# EAGLE design fm_1 (EAGLE 9.2.1)
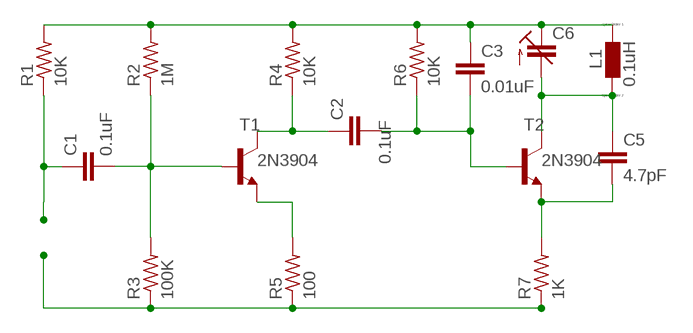
[diagram p0: schematic, sheet 1]

## Parts
C1  0.1uF  C-EU025-040X050  [C025-040X050]
C2  0.1uF  C-EU025-040X050  [C025-040X050]
C3  0.01uF  C-EU025-040X050  [C025-040X050]
C5  4.7pF  C-EU025-040X050  [C025-040X050]
C6  C-TRIMM808  [CTRIM808-BC]
L1  0.1uH  L0204/7  [0204/7]
R1  10K  R-US_0204/2V  [0204V]
R2  1M  R-US_0204/2V  [0204V]
R3  100K  R-US_0204/2V  [0204V]
R4  10K  R-US_0204/2V  [0204V]
R5  100  R-US_0204/2V  [0204V]
R6  10K  R-US_0204/2V  [0204V]
R7  1K  R-US_0204/2V  [0204V]
T1  2N3904  [TO92]
T2  2N3904  [TO92]

## Nets
N$1: C3.1 C6.1(E) L1.1 R1.2 R2.2 R4.2 R6.2
N$2: C1.1 R1.1
N$3: C1.2 R2.1 R3.2 T1.2(B)
N$4: R3.1 R5.1 R7.1
N$5: C2.1 R4.1 T1.1(C)
N$6: C2.2 C3.2 R6.1 T2.2(B)
N$7: C5.1 C6.2(A) L1.2 T2.1(C)
N$8: C5.2 R7.2 T2.3(E)
N$9: R5.2 T1.3(E)

## Library data of the parts
C1-C3 C5 = rcl:C-EU: CAPACITOR, European symbol; SPICEPREFIX: C
C6 = rcl:C-TRIMM: Trimm capacitor; SPICEPREFIX: C
L1 = eagle-ltspice:L: INDUCTOR, European symbol; SPICEMODEL: NONE; SPICEPREFIX: L
R1-R7 = rcl:R-US_: RESISTOR, American symbol; SPICEPREFIX: R
T1 T2 = transistor:2N3904: NPN TRANSISTOR

## Net classes
0 default: width 0.508 mm, drill 0.305 mm, clearance 0.508 mm

## Board
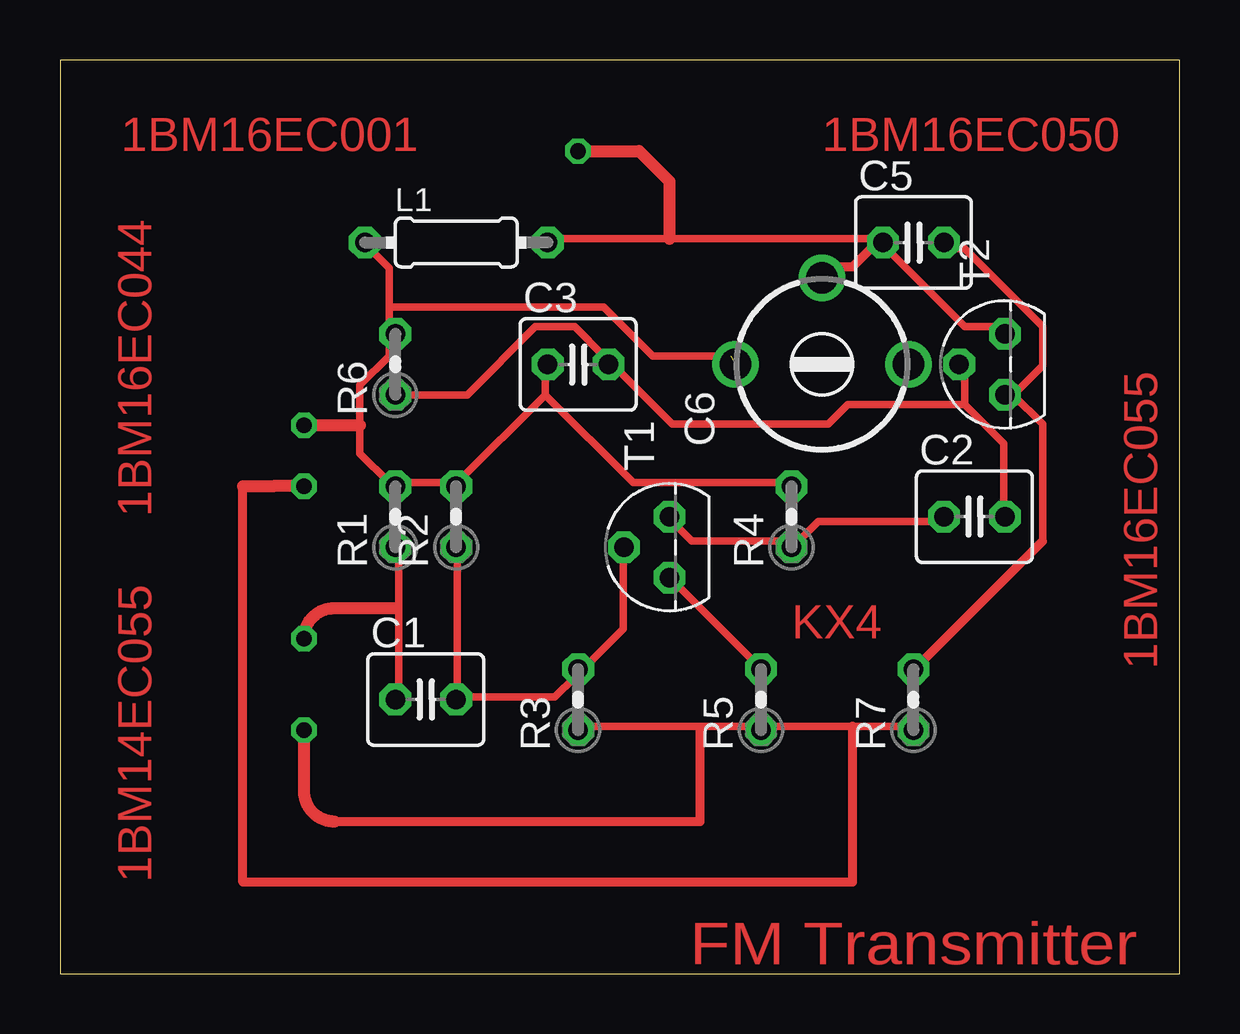
[diagram p1: board, top side]

Size 46.66 x 38.09 mm. Coordinates in mm from the lower left corner, seen from the top.
Outline: 0,0 46.66,0 46.66,38.09 0,38.09 0,0
Copper layers (1*16): Top 0.035mm / dielectric 1.5mm / Bottom 0.035mm
Design rules "default *": minimum track width 12mil, minimum drill 0.35mm, track to track 12mil, track to pad 6mil, pad to pad 6mil, via to via 8mil, smd to smd 6mil, copper to edge 40mil, drill to drill 12mil, minimum pad ring 10mil, minimum via ring 8mil, stop-mask expansion 4mil, vias tented up to drill 0mil, thermal gap 10mil

### Footprints (pad centres in the part's own frame; a part is rotated, then mirrored left to right if it is on the bottom)
C025-040X050 = drill 0.813 octagon: 1 -1.27,0; 2 1.27,0
CTRIM808-BC = drill 1.3: 1 -3.607,0; 2 0,3.607; 3 3.607,0
0204/7 = drill 0.813 octagon: 1 -3.81,0; 2 3.81,0
0204V = drill 0.813 octagon: 1 -1.27,0; 2 1.27,0
TO92 = drill 0.813 octagon: 1 1.27,0; 2 0,1.905; 3 -1.27,0

### Placement (x,y rotation side)
C1  15.24,11.43 0 top
C2  38.1,19.05 0 top
C3  21.59,25.4 0 top
C5  35.56,30.48 0 top
C6  31.75,25.4 0 top
L1  16.51,30.48 0 top
R1  13.97,19.05 90 top
R2  16.51,19.05 90 top
R3  21.59,11.43 90 top
R4  30.48,19.05 90 top
R5  29.21,11.43 90 top
R6  13.97,25.4 90 top
R7  35.56,11.43 90 top
T1  25.4,17.78 90 top
T2  39.37,25.4 90 top

### Tracks (layer width: path | path; a pad name or v marks a point on that pad's centre or on a via)
N$1  (1 unrouted)
  Top 0.305: 13.72,27.79 13.72,29.41 12.9,30.23 L1.1 | 13.72,27.79 13.72,26.92 | 27.94,25.76 24.69,25.76 24.46,25.98 22.66,27.79 13.72,27.79 | 20.22,24.13 20.22,25.35 C3.1 | 20.22,24.13 16.56,20.47 R2.2 16.15,20.47 14.12,20.47 R1.2 13.72,20.47 12.5,21.69 12.5,22.86 12.5,24.54 13.72,25.76 13.72,26.67 R6.2 | 20.22,24.13 23.88,20.47 30.38,20.47 R4.2
  Top 0.508: 12.5,22.86 10.16,22.86 | 13.72,26.92 R6.2
N$2
  Top 0.305: C1.1 14.12,11.53 14.12,17.63 R1.1
N$3
  Top 0.305: 16.56,11.53 20.62,11.53 21.44,12.34 R3.2 21.84,12.75 23.47,14.38 23.47,17.63 T1.2 | 16.56,11.53 16.56,17.63 R2.1 | 16.56,11.53 C1.2
N$4
  Top 0.305: R3.1 21.84,10.31 29.16,10.31 R5.1 29.57,10.31 33.02,10.31 35.26,10.31 R7.1
  Top 0.381: 33.02,10.31 33.02,3.81 7.62,3.81 7.62,20.32
  Top 0.508: 7.62,20.32 8.77,20.32
N$5
  Top 0.305: T1.1 25.5,18.85 26.31,18.03 30.38,18.03 R4.1 30.79,18.03 31.6,18.85 36.47,18.85 C2.1
N$6
  Top 0.305: 37.69,23.72 39.32,22.1 39.32,19.25 C2.2 | 37.69,23.72 37.69,25.35 T2.2 | R6.1 16.97,24.13 19.81,26.98 21.44,26.98 22.66,25.76 C3.2 23.06,25.35 25.5,22.91 32,22.91 32.82,23.72 37.69,23.72
N$7
  Top 0.305: L1.2 20.62,30.63 25.4,30.63 34.04,30.63 C5.1 34.44,30.23 37.69,26.98 39.32,26.98 T2.1
  Top 0.381: 34.04,30.48 33.02,29.46 32,29.46 C6.2
  Top 0.508: 25.4,30.63 25.4,33.02 | 34.04,30.48 C5.1
N$8
  Top 0.305: 40.95,18.03 40.95,22.91 39.73,24.13 | 35.66,12.75 R7.2 | 39.73,24.13 40.95,25.35 40.95,26.98 37.69,30.23 36.88,30.23 C5.2 | 39.73,24.13 T2.3
  Top 0.381: 40.95,18.03 35.66,12.75
N$9
  Top 0.305: R5.2 T1.3
N$10  (via drill 0.65 pad 0.55)
  Top 0.508: v10.16,13.97 arc-90 11.43,15.24 13.97,15.24
N$11  (via drill 0.65 pad 0.55)
  Top 0.381: 11.43,6.35 26.67,6.35 26.67,10.16
  Top 0.508: v10.16,10.16 10.16,7.62 arc90 11.43,6.35
N$12  (via drill 0.65 pad 0.55)
  Top 0.508: v21.59,34.29 24.13,34.29 25.4,33.02
N$13  (via drill 0.65 pad 0.55)
  other vias: 10.16,22.86
N$14  (via drill 0.65 pad 0.55)
  Top 0.508: v10.16,20.32 8.89,20.32

### Text on the board
Top: 1BM16EC001 | 1BM16EC050 | 1BM16EC044 | KX4 | 1BM16EC055 | 1BM14EC055 | FM Transmitter